# Altium schematic sheet MAIN_SCH.SchDoc
size A4; SheetNumber: 1; SheetTotal: 6
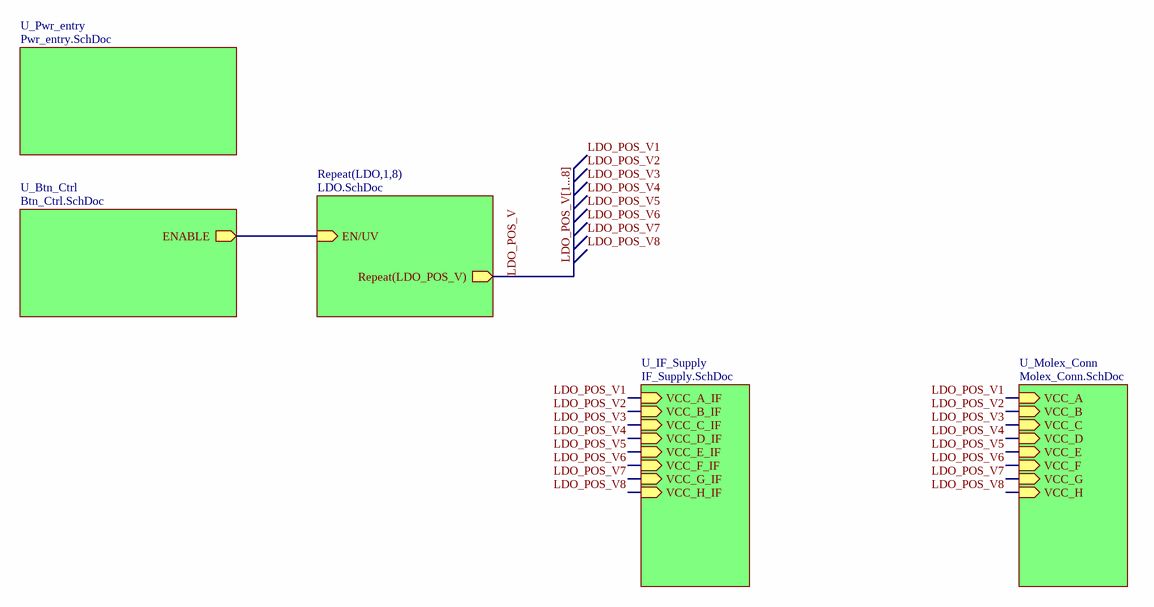
[diagram p0: MAIN_SCH.SchDoc]

## Sub-sheets
Repeat(LDO,1,8) = LDO.SchDoc: EN/UV (in), Repeat(LDO_POS_V) (out)
U_Btn_Ctrl = Btn_Ctrl.SchDoc: ENABLE (out)
U_IF_Supply = IF_Supply.SchDoc: VCC_A_IF (in), VCC_B_IF (in), VCC_C_IF (in), VCC_D_IF (in), VCC_E_IF (in), VCC_F_IF (in), VCC_G_IF (in), VCC_H_IF (in)
U_Molex_Conn = Molex_Conn.SchDoc: VCC_A (in), VCC_B (in), VCC_C (in), VCC_D (in), VCC_E (in), VCC_F (in), VCC_G (in), VCC_H (in)
U_Pwr_entry = Pwr_entry.SchDoc: no entries

## Nets
LDO_POS_V: sheet Repeat(LDO,1,8)/Repeat(LDO_POS_V)
LDO_POS_V1: sheet U_IF_Supply/VCC_A_IF, sheet U_Molex_Conn/VCC_A
LDO_POS_V2: sheet U_IF_Supply/VCC_B_IF, sheet U_Molex_Conn/VCC_B
LDO_POS_V3: sheet U_IF_Supply/VCC_C_IF, sheet U_Molex_Conn/VCC_C
LDO_POS_V4: sheet U_IF_Supply/VCC_D_IF, sheet U_Molex_Conn/VCC_D
LDO_POS_V5: sheet U_IF_Supply/VCC_E_IF, sheet U_Molex_Conn/VCC_E
LDO_POS_V6: sheet U_IF_Supply/VCC_F_IF, sheet U_Molex_Conn/VCC_F
LDO_POS_V7: sheet U_IF_Supply/VCC_G_IF, sheet U_Molex_Conn/VCC_G
LDO_POS_V8: sheet U_IF_Supply/VCC_H_IF, sheet U_Molex_Conn/VCC_H
(unnamed): sheet Repeat(LDO,1,8)/EN/UV, sheet U_Btn_Ctrl/ENABLE

## Buses and harness runs
bus LDO_POS_V[1...8]

## Notes on the sheet
- Labels drawn without touching a wire or pin: LDO_POS_V1, LDO_POS_V2, LDO_POS_V3, LDO_POS_V4, LDO_POS_V5, LDO_POS_V6, LDO_POS_V7, LDO_POS_V8
- Title
- Size:
- Date:
- A4
- Designer:
- Time:
- Sheet
- Revision:
- of
- University of Stuttgart
- ILH
- Pfaffenwaldring 47
- 70569 Stuttgart
- Germany
- File: